# EAGLE design SNES_RGBAmp_wCSYNC (EAGLE 7.7.0)
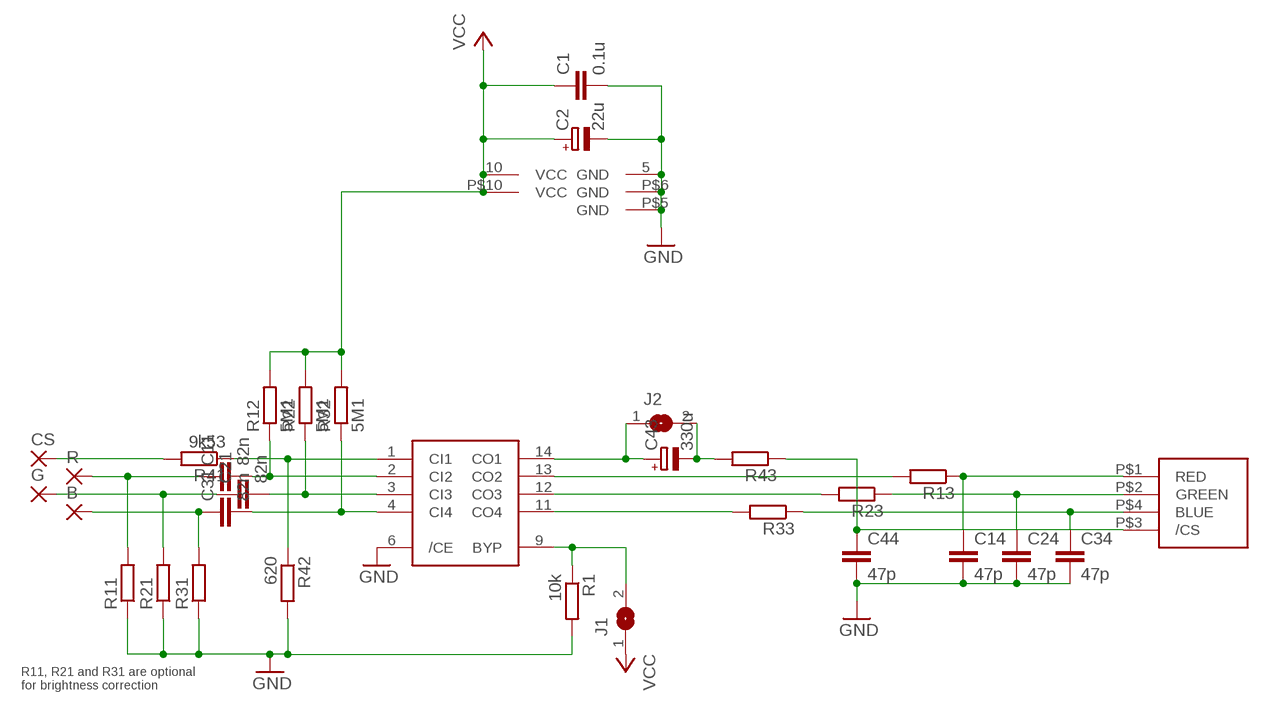
[diagram p0: schematic, sheet 1]

## Parts
B  SMD2  [SMD1,27-2,54]
C1  0.1u  C-EUC0603K  [C0603K]
C2  22u  CPOL-EUSMCB  [SMC_B]
C11  82n  C-EUC0603K  [C0603K]
C14  47p  C-EUC0603K  [C0603K]
C21  82n  C-EUC0603K  [C0603K]
C24  47p  C-EUC0603K  [C0603K]
C31  82n  C-EUC0603K  [C0603K]
C34  47p  C-EUC0603K  [C0603K]
C43  330u  CPOL-EUSMCD  [SMC_D]
C44  47p  C-EUC0603K  [C0603K]
CS  SMD2  [SMD1,27-2,54]
G  SMD2  [SMD1,27-2,54]
J1  SJ  [SJ]
J2  SJ  [SJ]
J3  SNES_MULTIAV_RGBC_ONLY  [SNES_MULTIAV_RGBC_ONLY]
R  SMD2  [SMD1,27-2,54]
R1  10k  R-EU_R0603  [R0603]
R11  R-EU_R0603  [R0603]
R12  5M1  R-EU_R0603  [R0603]
R13  R-EU_R0603  [R0603]
R21  R-EU_R0603  [R0603]
R22  5M1  R-EU_R0603  [R0603]
R23  R-EU_R0603  [R0603]
R31  R-EU_R0603  [R0603]
R32  5M1  R-EU_R0603  [R0603]
R33  R-EU_R0603  [R0603]
R41  9k53  R-EU_R0603  [R0603]
R42  620  R-EU_R0603  [R0603]
R43  R-EU_R0603  [R0603]
U1  THS7374  [THS7374]

## Nets
GND: C1.2 C2.- C14.2 C24.2 C34.2 C44.2 J3.P$5(GND) J3.P$6(GND) R1.2 R11.1 R21.1 R31.1 R42.2 U1.5(GND) U1.6(/CE)
N$1: C11.2 R12.1 U1.2(CI2)
N$2: C21.2 R22.1 U1.3(CI3)
N$3: J1.2 R1.1 U1.9(BYP)
N$4: C44.1 J3.P$3(/CS) R43.1
N$5: C14.1 J3.P$1(RED) R13.1
N$6: C24.1 J3.P$2(GREEN) R23.1
N$7: R23.2 U1.12(CO3)
N$8: R13.2 U1.13(CO2)
N$9: C34.1 J3.P$4(BLUE) R33.1
N$10: R41.1 R42.1 U1.1(CI1)
N$11: R33.2 U1.11(CO4)
N$14: C11.1 R11.2 R.1(P)
N$15: C21.1 G.1(P) R21.2
N$16: B.1(P) C31.1 R31.2
N$17: CS.1(P) R41.2
N$18: C43.+ J2.1 U1.14(CO1)
N$19: C43.- J2.2 R43.2
R9: C31.2 R32.1 U1.4(CI4)
VCC: C1.1 C2.+ J1.1 J3.P$10(VCC) R12.2 R22.2 R32.2 U1.10(VCC)

## Notes on the sheet
- R11, R21 and R31 are optional
  for brightness correction

## Library data of the parts
B CS G R = wirepad:SMD2: SMD PAD
C1 C11 C14 C21 C24 C31 C34 C44 = rcl:C-EU: CAPACITOR, European symbol
C2 C43 = rcl:CPOL-EU: POLARIZED CAPACITOR, European symbol
J1 J2 = jumper:SJ: SMD solder JUMPER
J3 = snes_div:SNES_MULTIAV_RGBC_ONLY
R1 R11-R13 R21-R23 R31-R33 R41-R43 = rcl:R-EU_: RESISTOR, European symbol
U1 = snes_div:THS7374

## Board
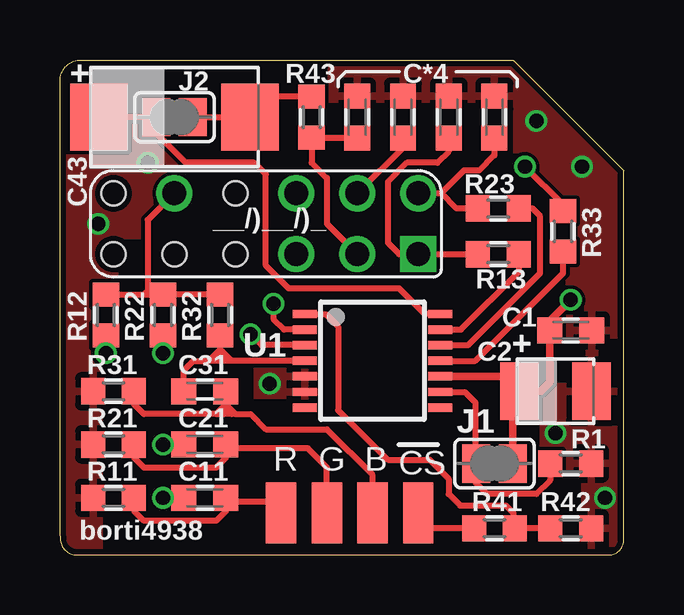
[diagram p1: board, top side]
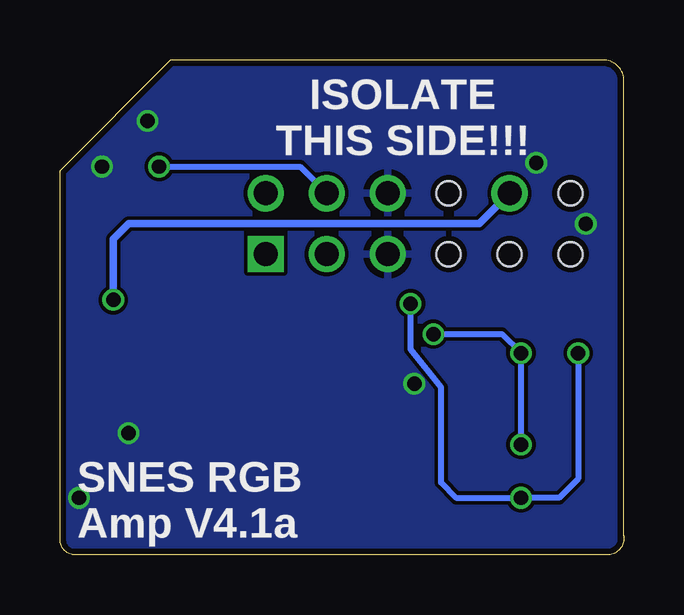
[diagram p2: board, bottom side, seen from below]

Size 23.5 x 20.64 mm. Coordinates in mm from the lower left corner, seen from the top.
Outline: 0,0.79 arc90 0.64,0 22.86,0 arc90 23.5,0.64 23.5,16.03 18.9,20.64 0.96,20.64 arc90 0,19.84 0,0.79
Copper layers (1*16): Top 0.035mm / dielectric 1.5mm / Bottom 0.035mm
Design rules "ITEADstudio_DRC": minimum track width 6mil, minimum drill 12mil, track to track 6mil, track to pad 6mil, pad to pad 6mil, via to via 6mil, smd to smd 0mil, copper to edge 10mil, drill to drill 10mil, minimum pad ring 10mil, minimum via ring 6mil, stop-mask expansion 2mil, vias tented up to drill 30mil, thermal gap 10mil
tRestrict: area 8.7,11.3 to 11.8,18.7; area 11.8,16.8 to 18.7,18.7; area 20.5,12.9 to 21.4,14; area 20.5,7.3 to 21.8,8.9; area 1.9,0.2 to 7.9,8.1; area 1.4,8.7 to 6.2,11.3; area 19.2,0.5 to 21.6,3.2; area 11,4.9 to 11.9,9.7; area 22.5,7.9 to 23.5,8.9; area 18.9,4.1 to 19.8,5.6; area 9.6,19.4 to 11,20.3; area 16.4,6 to 17.3,7; 2 more areas

### Footprints (pad centres in the part's own frame; a part is rotated, then mirrored left to right if it is on the bottom)
SMD1,27-2,54 = smd 1.27 x 2.54: 1 0,0
C0603K = smd 1.05 x 1.08: 1 -0.875,0; 2 0.875,0
SMC_B = smd 1.6 x 2.4: + -1.5,0; - 1.5,0
SMC_D = smd 2.4 x 2.8: + -3.15,0; - 3.15,0
SJ = smd 1.168 x 1.6: 1 -0.762,0; 2 0.762,0
SNES_MULTIAV_RGBC_ONLY = drill 1 square: P$1 6.35,-1.27 | drill 1: P$2 6.35,1.27; P$3 3.81,-1.27; P$4 3.81,1.27; P$5 1.27,-1.27; P$6 1.27,1.27; P$10 -3.81,1.27 | hole 1: -1.27,-1.27; -1.27,1.27; -3.81,-1.27; -6.35,-1.27; -6.35,1.27
R0603 = smd 1 x 1.1: 1 -0.85,0; 2 0.85,0
THS7374 = smd 0.35 x 1: 1 -1.95,-2.825; 2 -1.3,-2.825; 3 -0.65,-2.825; 4 0,-2.825; 5 0.65,-2.825; 6 1.3,-2.825; 7 1.95,-2.825; 8 1.95,2.825; 9 1.3,2.825; 10 0.65,2.825; 11 0,2.825; 12 -0.65,2.825; 13 -1.3,2.825; 14 -1.95,2.825

### Placement (x,y rotation side)
B  13.02,1.75 0 top
C1  21.28,9.37 0 top
C2  20.64,6.83 0 top
C11  6.04,2.38 180 top
C14  16.2,18.26 90 top
C21  6.04,4.6 180 top
C24  18.1,18.26 90 top
C31  6.04,6.83 180 top
C34  14.29,18.26 90 top
C43  4.77,18.26 0 top
C44  12.39,18.26 90 top
CS  14.93,1.75 0 top
G  11.12,1.75 0 top
J1  18.1,3.81 180 top
J2  4.77,18.26 0 top
J3  8.58,13.81 0 top
R  9.21,1.75 0 top
R1  21.28,3.81 0 top
R11  2.23,2.38 0 top
R12  1.91,10 90 top
R13  18.26,12.54 0 top
R21  2.23,4.6 0 top
R22  4.29,10 90 top
R23  18.26,14.45 0 top
R31  2.23,6.83 0 top
R32  6.67,10 90 top
R33  20.96,13.49 270 top
R41  18.1,1.11 180 top
R42  21.28,1.11 0 top
R43  10.48,18.26 90 top
U1  13.02,8.1 270 top

### Tracks (layer width: path | path; a pad name or v marks a point on that pad's centre or on a via)
GND  (via drill 0.6)
  other vias: 8.74,7.14 1.59,13.81 22.71,2.38 19.85,18.1 3.66,16.35 21.75,16.19 20.64,5.08
  pour Bottom: -0.95,-0.16 24.45,-0.16 24.45,21.43 -0.95,21.43
  pour Top: -0.95,-0.16 24.45,-0.16 24.45,21.43 -0.95,21.43
N$1  (via drill 0.6)
  Top 0.254: R12.1 v1.91,8.41 | C11.2 v4.29,2.38 | U1.2 9.34,9.4 8.89,9.84 v8.89,10.48
  Bottom 0.254: v1.91,8.41 1.91,3.18 2.7,2.38 v4.29,2.38 6.99,2.38 7.62,3.02 7.62,6.99 8.89,8.57 v8.89,10.48
N$2  (via drill 0.6)
  Top 0.254: C21.2 v4.29,4.6 | v4.29,8.41 R22.1 | U1.3 8.4,8.75 v7.94,9.21
  Bottom 0.254: v4.29,4.6 v4.29,8.41 5.08,9.21 v7.94,9.21
N$3
  Top 0.254: R1.1 20.43,3.12 19.85,2.54 17.78,2.54 17.31,3.02 17.31,3.62 J1.2 17.31,3.68 17.31,6.35 16.86,6.8 U1.9
N$4
  Top 0.254: C44.1 10.51,17.38 R43.1 10.48,16.35 11.12,15.72 11.12,13.81 J3.P$3
N$5
  Top 0.254: C14.1 16.2,16.83 15.72,16.35 14.45,16.35 13.66,15.56 13.66,13.02 14.13,12.54 J3.P$1 R13.1
N$6
  Top 0.254: C24.1 18.1,16.67 17.47,16.03 16.83,16.03 15.88,15.08 | R23.1 16.51,14.45 15.88,15.08 | J3.P$2 15.88,15.08
N$7
  Top 0.254: U1.12 17.01,8.75 20.01,11.75 20.01,14.13 19.69,14.45 R23.2
N$8
  Top 0.254: U1.13 16.7,9.4 19.11,11.8 R13.2
N$9  (via drill 0.6)
  Top 0.254: C34.1 14.29,16.99 J3.P$4 | v19.37,16.19 20.96,14.61 R33.1
  Bottom 0.254: v19.37,16.19 13.5,16.19 J3.P$4
N$10
  Top 0.254: R42.1 R41.1 18.9,1.17 18.9,1.75 18.58,2.06 16.67,2.06 16.2,2.54 16.2,3.18 15.4,3.97 13.66,3.97 11.59,6.03 11.59,9.53 11.07,10.05 U1.1
N$11
  Top 0.254: U1.11 17.31,8.1 20.96,11.75 R33.2
N$14
  Top 0.254: R11.2 3.08,1.85 3.5,1.43 6.51,1.43 6.91,1.83 C11.1 | C11.1 6.91,2.62 6.51,2.22 | R.1 9.21,2.22 7.07,2.22 C11.1
N$15
  Top 0.254: R21.2 3.08,4.07 3.5,3.65 6.51,3.65 6.91,4.05 C21.1 7.07,4.45 10.32,4.45 11.12,3.65 G.1
N$16
  Top 0.254: R31.2 3.08,6.29 3.5,5.87 6.51,5.87 | 6.51,5.87 6.91,6.27 C31.1 6.91,6.27 7.31,5.87 | B.1 13.02,3.33 11.12,5.24 8.58,5.24 7.94,5.87 7.31,5.87 | 7.31,5.87 7.15,5.87 | 7.15,5.87 6.83,5.87 | 6.51,5.87 6.83,5.87 | 6.83,5.87 6.99,6.03 7.15,5.87
N$17
  Top 0.254: R41.2 14.93,1.11 CS.1
N$18
  Top 0.254: C43.+ J2.1 3.97,18.22 4.13,17.46 5.24,16.35 8.1,16.35 8.58,15.88 8.58,12.07 9.53,11.11 14.13,11.11 15.2,10.05 U1.14
N$19
  Top 0.254: R43.2 8.77,19.11 C43.- J2.2
R9
  Top 0.254: 5.4,7.23 C31.2 5.16,7.7 5.56,8.1 6.2,8.1 | U1.4 7.15,8.1 | 6.67,8.1 6.2,8.1 | 6.2,8.1 6.67,8.57 7.15,8.1 | 7.15,8.1 6.67,8.1 | 6.67,8.1 6.83,8.26 6.67,8.26 | 6.51,8.26 6.67,8.26 | 6.67,8.26 R32.1
VCC  (via drill 0.6)
  Top 0.254: R12.2 3.5,10.85 | 3.5,10.85 R22.2 | R32.2 R22.2 | J3.P$10 3.66,13.97 3.66,11.01 3.5,10.85 | 3.97,11.17 R22.2
  Top 0.305: v21.28,10.64 20.48,9.84 20.48,9.45 C1.1 20.4,7.22 20.01,6.83 C2.+ | U1.10 18.52,7.45 C2.+ | J1.1 18.86,6.55 C2.+
  Bottom 0.305: J3.P$10 6.04,13.81 20.64,13.81 21.28,13.18 v21.28,10.64

### Text on the board
tPlace: J2 | __/)__/)_ | U1 | J1 | borti4938
tNames: + | R43 | C*4 | C43 | R23 | R33 | R13 | C1 | R12 | R22 | R32 | R31 | C31 | C2 | + | R21 | C21 | R1 | R11 | C11 | R41 | R42
bNames: ISOLATE / THIS SIDE!!! | SNES RGB / Amp V4.1a